# Altium schematic sheet [06] - Sensor.SchDoc: =ProjectName
size A4; CheckedBy: Ven; Author: Ven; CompanyName: HUST; Revision: V.1.0
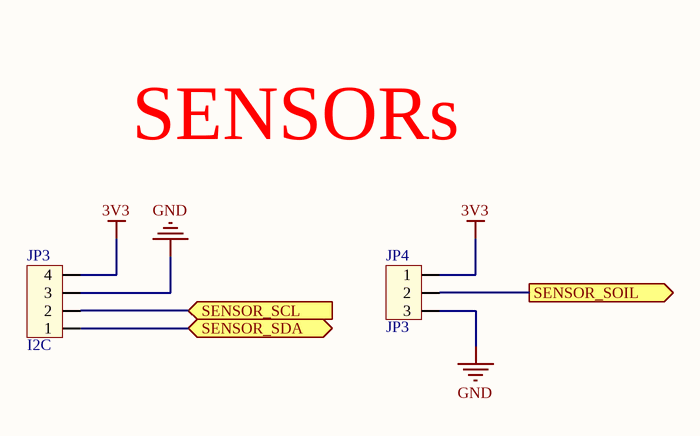
[diagram p0: [06] - Sensor.SchDoc]

## Parts
JP3  I2C  [CON4]
JP4  JP3  [CON3]

## Ports
SENSOR_SCL (in), SENSOR_SDA (bidir), SENSOR_SOIL (out)

## Nets
3V3: JP3.4 JP4.1
GND: JP3.3 JP4.3
SENSOR_SCL: JP3.2 ; port SENSOR_SCL
SENSOR_SDA: JP3.1 ; port SENSOR_SDA
SENSOR_SOIL: JP4.2 ; port SENSOR_SOIL

## Notes on the sheet
- SENSORs
- Project:
- Page Contents:
- Size:
- Date:
- A4
- Checked by:
- Time:
- Revision:
- Sheet
- of
- File:

## Library data of the parts
JP3 = Con4: Connector 4; Value: Connector 4
JP4 = Con3: Connector 3; Value: Connector 3